# Altium project SaraKit_MainBoard.PrjPcb (part 2 of 3)

## Sheet Audio_SpeakerDriver.SchDoc
size A4; SheetNumber: 3; SheetTotal: 6
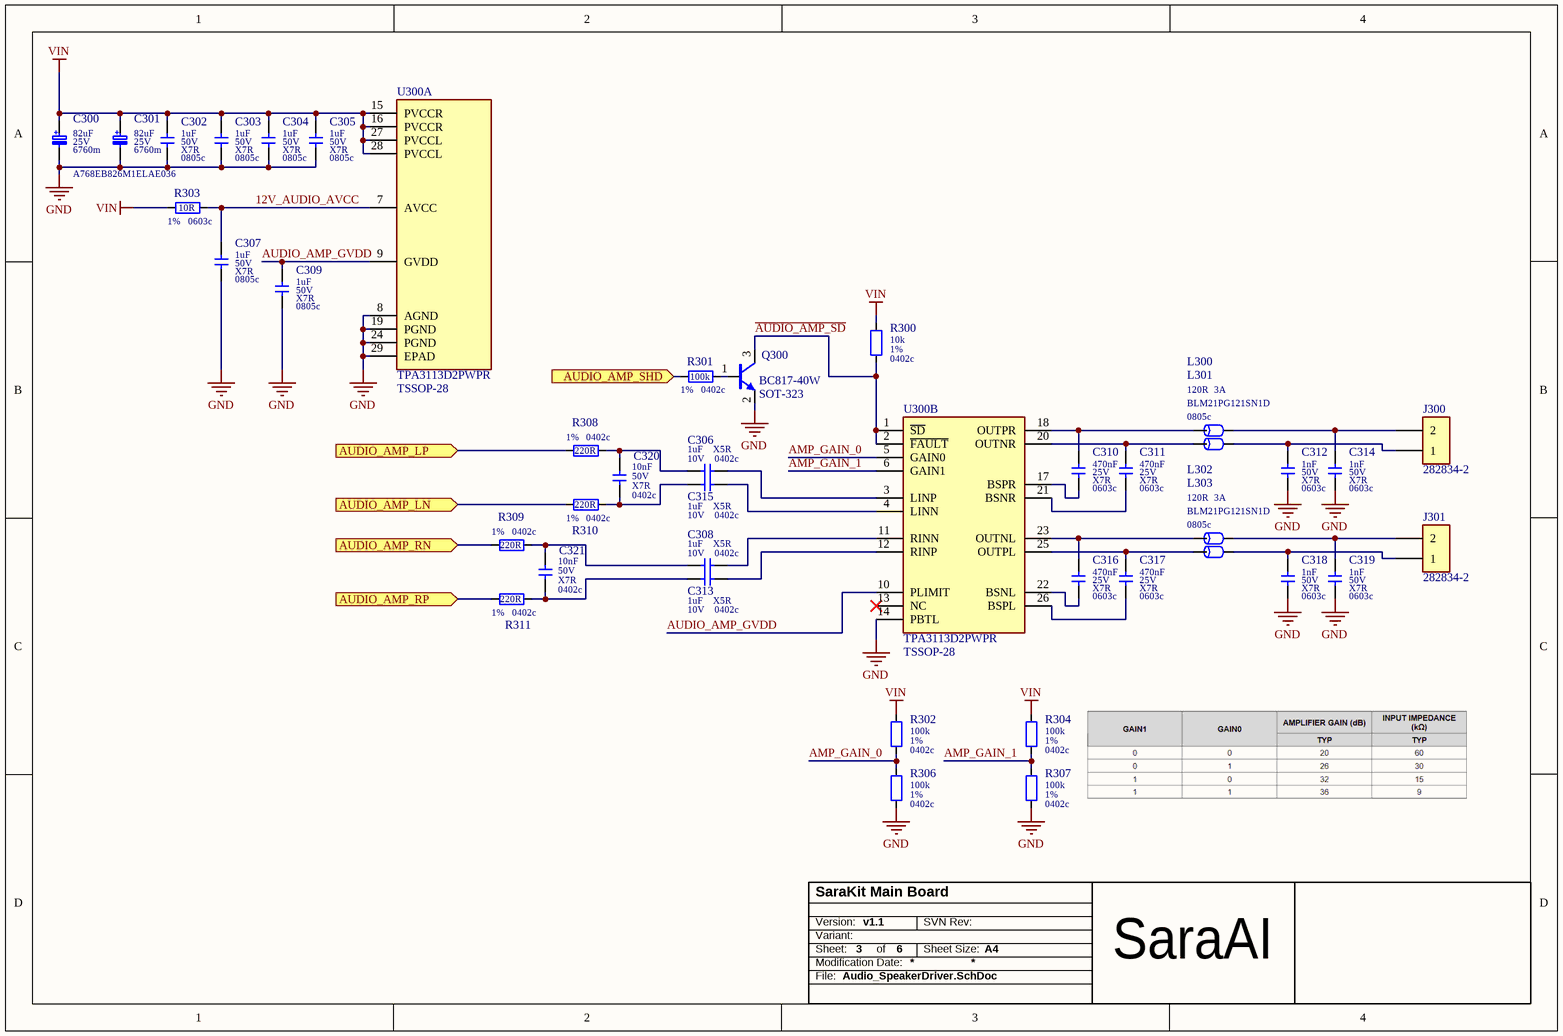
[diagram p2: Audio_SpeakerDriver.SchDoc]

### Parts
C300  09 Parameter 2: 25V  08 Parameter 1: 82uF  07 Package: 6760m  [CAPAE660X60L]  (hidden comment: A768EB826M1ELAE036)
C301  09 Parameter 2: 25V  08 Parameter 1: 82uF  07 Package: 6760m  [CAPAE660X60L]  (hidden comment: A768EB826M1ELAE036)
C302  11 Parameter 4: X7R  07 Package: 0805c  08 Parameter 1: 1uF  09 Parameter 2: 50V  [CAPC2013X145L]  (hidden comment: CL21B105KBFNNNG)
C303  11 Parameter 4: X7R  07 Package: 0805c  08 Parameter 1: 1uF  09 Parameter 2: 50V  [CAPC2013X145L]  (hidden comment: CL21B105KBFNNNG)
C304  11 Parameter 4: X7R  07 Package: 0805c  08 Parameter 1: 1uF  09 Parameter 2: 50V  [CAPC2013X145L]  (hidden comment: CL21B105KBFNNNG)
C305  11 Parameter 4: X7R  07 Package: 0805c  08 Parameter 1: 1uF  09 Parameter 2: 50V  [CAPC2013X145L]  (hidden comment: CL21B105KBFNNNG)
C306  11 Parameter 4: X5R  07 Package: 0402c  08 Parameter 1: 1uF  09 Parameter 2: 10V  [CAPC1005X60L]  (hidden comment: CL05A105KP5NNNC)
C307  11 Parameter 4: X7R  07 Package: 0805c  08 Parameter 1: 1uF  09 Parameter 2: 50V  [CAPC2013X145L]  (hidden comment: CL21B105KBFNNNG)
C308  11 Parameter 4: X5R  07 Package: 0402c  08 Parameter 1: 1uF  09 Parameter 2: 10V  [CAPC1005X60L]  (hidden comment: CL05A105KP5NNNC)
C309  11 Parameter 4: X7R  07 Package: 0805c  08 Parameter 1: 1uF  09 Parameter 2: 50V  [CAPC2013X145L]  (hidden comment: CL21B105KBFNNNG)
C310  11 Parameter 4: X7R  07 Package: 0603c  08 Parameter 1: 470nF  09 Parameter 2: 25V  [CAPC1608X90L]  (hidden comment: CL10B474KA8NNNC)
C311  11 Parameter 4: X7R  07 Package: 0603c  08 Parameter 1: 470nF  09 Parameter 2: 25V  [CAPC1608X90L]  (hidden comment: CL10B474KA8NNNC)
C312  11 Parameter 4: X7R  07 Package: 0603c  08 Parameter 1: 1nF  09 Parameter 2: 50V  [CAPC1608X90L]  (hidden comment: CL10B102KB8NNNC)
C313  11 Parameter 4: X5R  07 Package: 0402c  08 Parameter 1: 1uF  09 Parameter 2: 10V  [CAPC1005X60L]  (hidden comment: CL05A105KP5NNNC)
C314  11 Parameter 4: X7R  07 Package: 0603c  08 Parameter 1: 1nF  09 Parameter 2: 50V  [CAPC1608X90L]  (hidden comment: CL10B102KB8NNNC)
C315  11 Parameter 4: X5R  07 Package: 0402c  08 Parameter 1: 1uF  09 Parameter 2: 10V  [CAPC1005X60L]  (hidden comment: CL05A105KP5NNNC)
C316  11 Parameter 4: X7R  07 Package: 0603c  08 Parameter 1: 470nF  09 Parameter 2: 25V  [CAPC1608X90L]  (hidden comment: CL10B474KA8NNNC)
C317  11 Parameter 4: X7R  07 Package: 0603c  08 Parameter 1: 470nF  09 Parameter 2: 25V  [CAPC1608X90L]  (hidden comment: CL10B474KA8NNNC)
C318  11 Parameter 4: X7R  07 Package: 0603c  08 Parameter 1: 1nF  09 Parameter 2: 50V  [CAPC1608X90L]  (hidden comment: CL10B102KB8NNNC)
C319  11 Parameter 4: X7R  07 Package: 0603c  08 Parameter 1: 1nF  09 Parameter 2: 50V  [CAPC1608X90L]  (hidden comment: CL10B102KB8NNNC)
C320  11 Parameter 4: X7R  07 Package: 0402c  08 Parameter 1: 10nF  09 Parameter 2: 50V  [CAPC1005X60L]  (hidden comment: CL05B103KB5NNN)
C321  11 Parameter 4: X7R  07 Package: 0402c  08 Parameter 1: 10nF  09 Parameter 2: 50V  [CAPC1005X60L]  (hidden comment: CL05B103KB5NNN)
J300  282834-2  [TE 282834-2]
J301  282834-2  [TE 282834-2]
L300  09 Parameter 2: 3A  08 Parameter 1: 120R  07 Package: 0805c  [INDC2013X105L]  (hidden comment: BLM21PG121SN1D)
L301  BLM21PG121SN1D  [INDC2013X105L]  (value not drawn)
L302  09 Parameter 2: 3A  08 Parameter 1: 120R  07 Package: 0805c  [INDC2013X105L]  (hidden comment: BLM21PG121SN1D)
L303  BLM21PG121SN1D  [INDC2013X105L]  (value not drawn)
Q300  07 Package: SOT-323  [SOT65P210X110-3L]  (hidden comment: BC817-40W)
R300  07 Package: 0402c  09 Parameter 2: 1%  08 Parameter 1: 10k  [RESC1005X40L]  (hidden comment: RC0402FR-0710KL)
R301  07 Package: 0402c  09 Parameter 2: 1%  08 Parameter 1: 100k  [RESC1005X40L]  (hidden comment: RC0402FR-07100KL)
R302  07 Package: 0402c  09 Parameter 2: 1%  08 Parameter 1: 100k  [RESC1005X40L]  (hidden comment: RC0402FR-07100KL)
R303  07 Package: 0603c  09 Parameter 2: 1%  08 Parameter 1: 10R  [RESC1608X55L]  (hidden comment: RC0603FR-0710RL)
R304  07 Package: 0402c  09 Parameter 2: 1%  08 Parameter 1: 100k  [RESC1005X40L]  (hidden comment: RC0402FR-07100KL)
R306  07 Package: 0402c  09 Parameter 2: 1%  08 Parameter 1: 100k  [RESC1005X40L]  (hidden comment: RC0402FR-07100KL)
R307  07 Package: 0402c  09 Parameter 2: 1%  08 Parameter 1: 100k  [RESC1005X40L]  (hidden comment: RC0402FR-07100KL)
R308  07 Package: 0402c  09 Parameter 2: 1%  08 Parameter 1: 220R  [RESC1005X40L]  (hidden comment: RC0402FR-07220RL)
R309  07 Package: 0402c  09 Parameter 2: 1%  08 Parameter 1: 220R  [RESC1005X40L]  (hidden comment: RC0402FR-07220RL)
R310  07 Package: 0402c  09 Parameter 2: 1%  08 Parameter 1: 220R  [RESC1005X40L]  (hidden comment: RC0402FR-07220RL)
R311  07 Package: 0402c  09 Parameter 2: 1%  08 Parameter 1: 220R  [RESC1005X40L]  (hidden comment: RC0402FR-07220RL)
U300  07 Package: TSSOP-28  [TSOP65P640X120_HS-29L]  (hidden comment: TPA3113D2PWPR)  (parts A,B of 2)

### Ports
AUDIO_AMP_LN (in), AUDIO_AMP_LP (in), AUDIO_AMP_RN (in), AUDIO_AMP_RP (in), AUDIO_AMP_SHD (in)

### Nets
GND: C300.2 C301.2 C302.1 C303.1 C304.1 C305.1 C307.1 C309.1 C312.1 C314.1 C318.1 C319.1 Q300.2(E) R306.1 R307.1 U300.8(AGND) U300.14(PBTL) U300.19(PGND) U300.24(PGND) U300.29(EPAD)
VIN: C300.1 C301.1 C302.2 C303.2 C304.2 C305.2 R300.2 R302.2 R303.1 R304.2 U300.15(PVCCR) U300.16(PVCCR) U300.27(PVCCL) U300.28(PVCCL)
12V_AUDIO_AVCC: C307.2 R303.2 U300.7(AVCC)
~{AUDIO_AMP_SD}: Q300.3(C) R300.1 U300.1(~{SD}) U300.2(~{FAULT})
AMP_GAIN_0: R302.1 R306.2 U300.5(GAIN0)
AMP_GAIN_1: R304.1 R307.2 U300.6(GAIN1)
AUDIO_AMP_GVDD: C309.2 U300.9(GVDD) U300.10(PLIMIT)
AUDIO_AMP_LN: R310.1 ; port AUDIO_AMP_LN
AUDIO_AMP_LP: R308.1 ; port AUDIO_AMP_LP
AUDIO_AMP_RN: R309.1 ; port AUDIO_AMP_RN
AUDIO_AMP_RP: R311.1 ; port AUDIO_AMP_RP
G4/AMP_SHD: R301.1 ; port AUDIO_AMP_SHD
NetC306_1: C306.1 U300.3(LINP)
NetC306_2: C306.2 C320.2 R308.2
NetC308_1: C308.1 U300.11(RINN)
NetC308_2: C308.2 C321.2 R309.2
NetC310_1: C310.1 U300.17(BSPR)
NetC310_2: C310.2 L300.1 U300.18(OUTPR)
NetC311_1: C311.1 U300.21(BSNR)
NetC311_2: C311.2 L301.1 U300.20(OUTNR)
NetC312_2: C312.2 J300.1 L301.2
NetC313_1: C313.1 U300.12(RINP)
NetC313_2: C313.2 C321.1 R311.2
NetC314_2: C314.2 J300.2 L300.2
NetC315_1: C315.1 U300.4(LINN)
NetC315_2: C315.2 C320.1 R310.2
NetC316_1: C316.1 U300.22(BSNL)
NetC316_2: C316.2 L302.1 U300.23(OUTNL)
NetC317_1: C317.1 U300.26(BSPL)
NetC317_2: C317.2 L303.1 U300.25(OUTPL)
NetC318_2: C318.2 J301.1 L303.2
NetC319_2: C319.2 J301.2 L302.2
NetQ300_1: Q300.1(B) R301.2

Not connected (* = marked no-connect by the designer): U300 13(NC)*

### Notes on the sheet
- Version:
- SVN Rev:
- Sheet:
- File:
- Modification Date:
- Variant:
- of
- Sheet Size:
- A4
- SaraAI
- (in symbol 498) +

### Library data of the parts
C300 C301 = 498: SMT 6760m 82uF 25V 0,2 36mOhm 1.255A 125°; 03 Manufacturer: Kemet; 00 Index: 498; 01 Name: CAPACITOR POLYMER A768EB826M1ELAE036 Kemet; 04 Main Group: CAPACITOR; 05 Sub Group: POLYMER; 10 Parameter 3: 0,2; 16 Replacements: 25SVPK82M; Library Directory: sym_basics/; Fotprint Directory: fot_ipc/; 06 Assembly: SMT; 11 Parameter 4: 36mOhm; 12 Parameter 5: 1.255A; 13 Parameter 6: 125°; 14 Modification Date: 09.03.2021; ComponentLink1Description: DATASHEET; ComponentLink1URL: https://pl.mouser.com/datasheet/2/212/1/KEM_A4088_A768-1864506.pdf; 02 MPN: A768EB826M1ELAE036
C302-C305 C307 C309 = 30: SMT 0805c 1uF 50V 10% X7R 6.9MHz 125'C; 03 Manufacturer: Samsung; 00 Index: 30; 01 Name: CAPACITOR CERAMIC CL21B105KBFNNNG Samsung; 05 Sub Group: CERAMIC; 04 Main Group: CAPACITOR; 06 Assembly: SMT; 12 Parameter 5: 6.9MHz; 13 Parameter 6: 125'C; 14 Modification Date: 16.11.2020; ComponentLink1Description: DATASHEET; ComponentLink1URL: E:\Praca\Mindsailors\Mindsailors Altium\Database Library\Datasheets\CAPACITOR\Samsung CL21B105KBFNNNG.pdf; 02 MPN: CL21B105KBFNNNG; 10 Parameter 3: 10%
C306 C308 C313 C315 = 154: SMT 0402c 1uF 10V 10% X5R 10.2MHz 85'C; 03 Manufacturer: Samsung; 00 Index: 154; 01 Name: CAPACITOR THICK FILM CL05A105KP5NNNC Samsung; 05 Sub Group: THICK FILM; 04 Main Group: CAPACITOR; 06 Assembly: SMT; 12 Parameter 5: 10.2MHz; 13 Parameter 6: 85'C; 14 Modification Date: 16.11.2020; ComponentLink1Description: DATASHEET; ComponentLink1URL: E:\Praca\Mindsailors\Mindsailors Altium\Database Library\Datasheets\CAPACITOR\Samsung CL05A105KP5NNNC.pdf; 02 MPN: CL05A105KP5NNNC; 10 Parameter 3: 10%
C310 C311 C316 C317 = 212: SMT 0603c 470nF 25V 10% X7R 125°C; 03 Manufacturer: Samsung; 00 Index: 212; 01 Name: CAPACITOR CERAMIC CL10B474KA8NNNC Samsung; 05 Sub Group: CERAMIC; 04 Main Group: CAPACITOR; 06 Assembly: SMT; 13 Parameter 6: 125°C; 14 Modification Date: 25.01.2021; ComponentLink1Description: DATASHEET; ComponentLink1URL: http://weblib.samsungsem.com/mlcc/mlcc-ec-data-sheet.do?partNumber=CL10B474KA8NNN; 02 MPN: CL10B474KA8NNNC; 10 Parameter 3: 10%
C312 C314 C318 C319 = 191: SMT 0603c 1nF 50V 10% X7R 125°C; 03 Manufacturer: Samsung; 00 Index: 191; 01 Name: CAPACITOR CERAMIC CL10B102KB8NNNC Samsung; 05 Sub Group: CERAMIC; Library Directory: sym_basics/; Fotprint Directory: fot_ipc/; 04 Main Group: CAPACITOR; 06 Assembly: SMT; 13 Parameter 6: 125°C; 14 Modification Date: 25.01.2021; ComponentLink1Description: DATASHEET; ComponentLink1URL: http://weblib.samsungsem.com/mlcc/mlcc-ec-data-sheet.do?partNumber=CL10B102KB8NNN; 02 MPN: CL10B102KB8NNNC; 10 Parameter 3: 10%
C320 C321 = 451: SMT 0402c 10nF 50V 0,1 X7R 125°C; 03 Manufacturer: Samsung; 00 Index: 451; 01 Name: CAPACITOR CERAMIC CL05B103KB5NNN Samsung; 05 Sub Group: CERAMIC; 10 Parameter 3: 10%; 04 Main Group: CAPACITOR; 06 Assembly: SMT; 13 Parameter 6: 125°C; 14 Modification Date: 11.02.2021; ComponentLink1Description: DATASHEET; ComponentLink1URL: http://weblib.samsungsem.com/mlcc/mlcc-ec-data-sheet.do?partNumber=CL05B103KB5NNN; 02 MPN: CL05B103KB5NNN
J300 J301 = 978: THT 1x2 2.54mm Straight 150V 10A; 03 Manufacturer: TE Connectivity; 00 Index: 978; 01 Name: CONNECTOR WIRE 282834-2 TE Connectivity; 04 Main Group: CONNECTOR; 05 Sub Group: WIRE; Library Directory: sym_basics/; Fotprint Directory: fot_other/; 06 Assembly: THT; 13 Parameter 6: 10A; 14 Modification Date: 03.01.2022; ComponentLink1Description: DATASHEET; ComponentLink1URL: https://www.te.com/usa-en/product-282834-2.html; 09 Parameter 2: 2.54mm; 08 Parameter 1: 1x2; 11 Parameter 4: Straight; 12 Parameter 5: 150V; 07 Package: *; 02 MPN: 282834-2
L300-L303 = 499: SMT 0805c 120R 3A 0.035Ohm 350MHz; 03 Manufacturer: Murata; 00 Index: 499; 01 Name: INDUCTOR BEAD BLM21PG121SN1D Murata; 04 Main Group: INDUCTOR; 05 Sub Group: BEAD; 06 Assembly: SMT; 12 Parameter 5: 0.035Ohm; 13 Parameter 6: 350MHz; 14 Modification Date: 09.03.2021; ComponentLink1Description: DATASHEET; ComponentLink1URL: https://www.murata.com/en-global/api/pdfdownloadapi?cate=cgsubChipFerriBead&partno=BLM21PG121SZ1%23; 02 MPN: BLM21PG121SN1D
  L301 L303: 09 Parameter 2: 3A; 08 Parameter 1: 120R; 07 Package: 0805c
Q300 = 93: SMT SOT-323 NPN 45V 0.5A 0.2W; 03 Manufacturer: Nexperia; 00 Index: 93; 01 Name: TRANSISTOR BIPOLAR BC817-40W Nexperia; 04 Main Group: TRANSISTOR; 05 Sub Group: BIPOLAR; 06 Assembly: SMT; 13 Parameter 6: 0.2W; 14 Modification Date: 16.11.2020; ComponentLink1Description: DATASHEET; ComponentLink1URL: E:\Praca\Mindsailors\Mindsailors Altium\Database Library\Datasheets\TRANSISTOR\Nexperia BC817W Series.pdf; 08 Parameter 1: NPN; 11 Parameter 4: 45V; 12 Parameter 5: 0.5A; 02 MPN: BC817-40W
R300 = 15: as R109 on sheet Main; 04 Main Group: RESISTOR; 06 Assembly: SMT; 11 Parameter 4: 100ppm/K; 12 Parameter 5: 50V; 14 Modification Date: 16.11.2020; ComponentLink1Description: DATASHEET; ComponentLink1URL: E:\Praca\Mindsailors\Mindsailors Altium\Database Library\Datasheets\RESISTOR\Yageo RC_L Series.pdf; 10 Parameter 3: 62.5mW; 02 MPN: RC0402FR-0710KL
R301 = 18: SMT 0402c 100k 1% 62.5mW 100ppm/K 50V; 03 Manufacturer: Yageo; 00 Index: 18; 01 Name: RESISTOR THICK FILM RC0402FR-07100KL Yageo; 05 Sub Group: THICK FILM; 04 Main Group: RESISTOR; 06 Assembly: SMT; 11 Parameter 4: 100ppm/K; 12 Parameter 5: 50V; 14 Modification Date: 16.11.2020; ComponentLink1Description: DATASHEET; ComponentLink1URL: E:\Praca\Mindsailors\Mindsailors Altium\Database Library\Datasheets\RESISTOR\Yageo RC_L Series.pdf; 10 Parameter 3: 62.5mW; 02 MPN: RC0402FR-07100KL
R302 R304 R306 R307 = 18: SMT 0402c 100k 1% 62.5mW 100ppm/K 50V; 03 Manufacturer: Yageo; 00 Index: 18; 01 Name: RESISTOR THICK FILM RC0402FR-07100KL Yageo; 05 Sub Group: THICK FILM; Library Directory: sym_basics/; Fotprint Directory: fot_ipc/; 04 Main Group: RESISTOR; 06 Assembly: SMT; 11 Parameter 4: 100ppm/K; 12 Parameter 5: 50V; 14 Modification Date: 16.11.2020; ComponentLink1Description: DATASHEET; ComponentLink1URL: E:\Praca\Mindsailors\Mindsailors Altium\Database Library\Datasheets\RESISTOR\Yageo RC_L Series.pdf; 10 Parameter 3: 62.5mW; 02 MPN: RC0402FR-07100KL
R303 = 265: SMT 0603c 10R 1% 100mW 100ppm/K 75V; 03 Manufacturer: Yageo; 00 Index: 265; 01 Name: RESISTOR THICK FILM RC0603FR-0710RL Yageo; 05 Sub Group: THICK FILM; 04 Main Group: RESISTOR; 06 Assembly: SMT; 11 Parameter 4: 100ppm/K; 12 Parameter 5: 75V; 14 Modification Date: 25.01.2021; ComponentLink1Description: DATASHEET; ComponentLink1URL: https://www.yageo.com/upload/media/product/products/datasheet/rchip/PYu-RC_Group_51_RoHS_L_11.pdf; 10 Parameter 3: 100mW; 02 MPN: RC0603FR-0710RL
R308-R311 = 605: SMT 0402c 220R 1% 62.5mW 100ppm/K 50V; 03 Manufacturer: Yageo; 00 Index: 605; 01 Name: RESISTOR THICK FILM RC0402FR-07220RL Yageo; 05 Sub Group: THICK FILM; Library Directory: sym_basics/; Fotprint Directory: fot_ipc/; 04 Main Group: RESISTOR; 06 Assembly: SMT; 11 Parameter 4: 100ppm/K; 12 Parameter 5: 50V; 14 Modification Date: 10.05.2021; ComponentLink1Description: DATASHEET; ComponentLink1URL: https://www.yageo.com/upload/media/product/products/datasheet/rchip/PYu-RC_Group_51_RoHS_L_11.pdf; 10 Parameter 3: 62.5mW; 02 MPN: RC0402FR-07220RL
U300 = 497: SMT TSSOP-28 Speaker 8V - 26V 2x 6W; 03 Manufacturer: Texas Instruments; 00 Index: 497; 01 Name: IC DRIVER TPA3113D2PWPR Texas Instruments; 04 Main Group: IC; 05 Sub Group: DRIVER; 11 Parameter 4: 8V - 26V; 12 Parameter 5: 2x 6W; 06 Assembly: SMT; 14 Modification Date: 08.03.2021; ComponentLink1Description: DATASHEET; ComponentLink1URL: https://www.ti.com/lit/ds/symlink/tpa3113d2.pdf?ts=1615202642368&ref_url=https%253A%252F%252Fwww.google.com%252F; 08 Parameter 1: Speaker; 02 MPN: TPA3113D2PWPR

## Sheet MotorsController.SchDoc
size A3; SheetNumber: 4; SheetTotal: 6
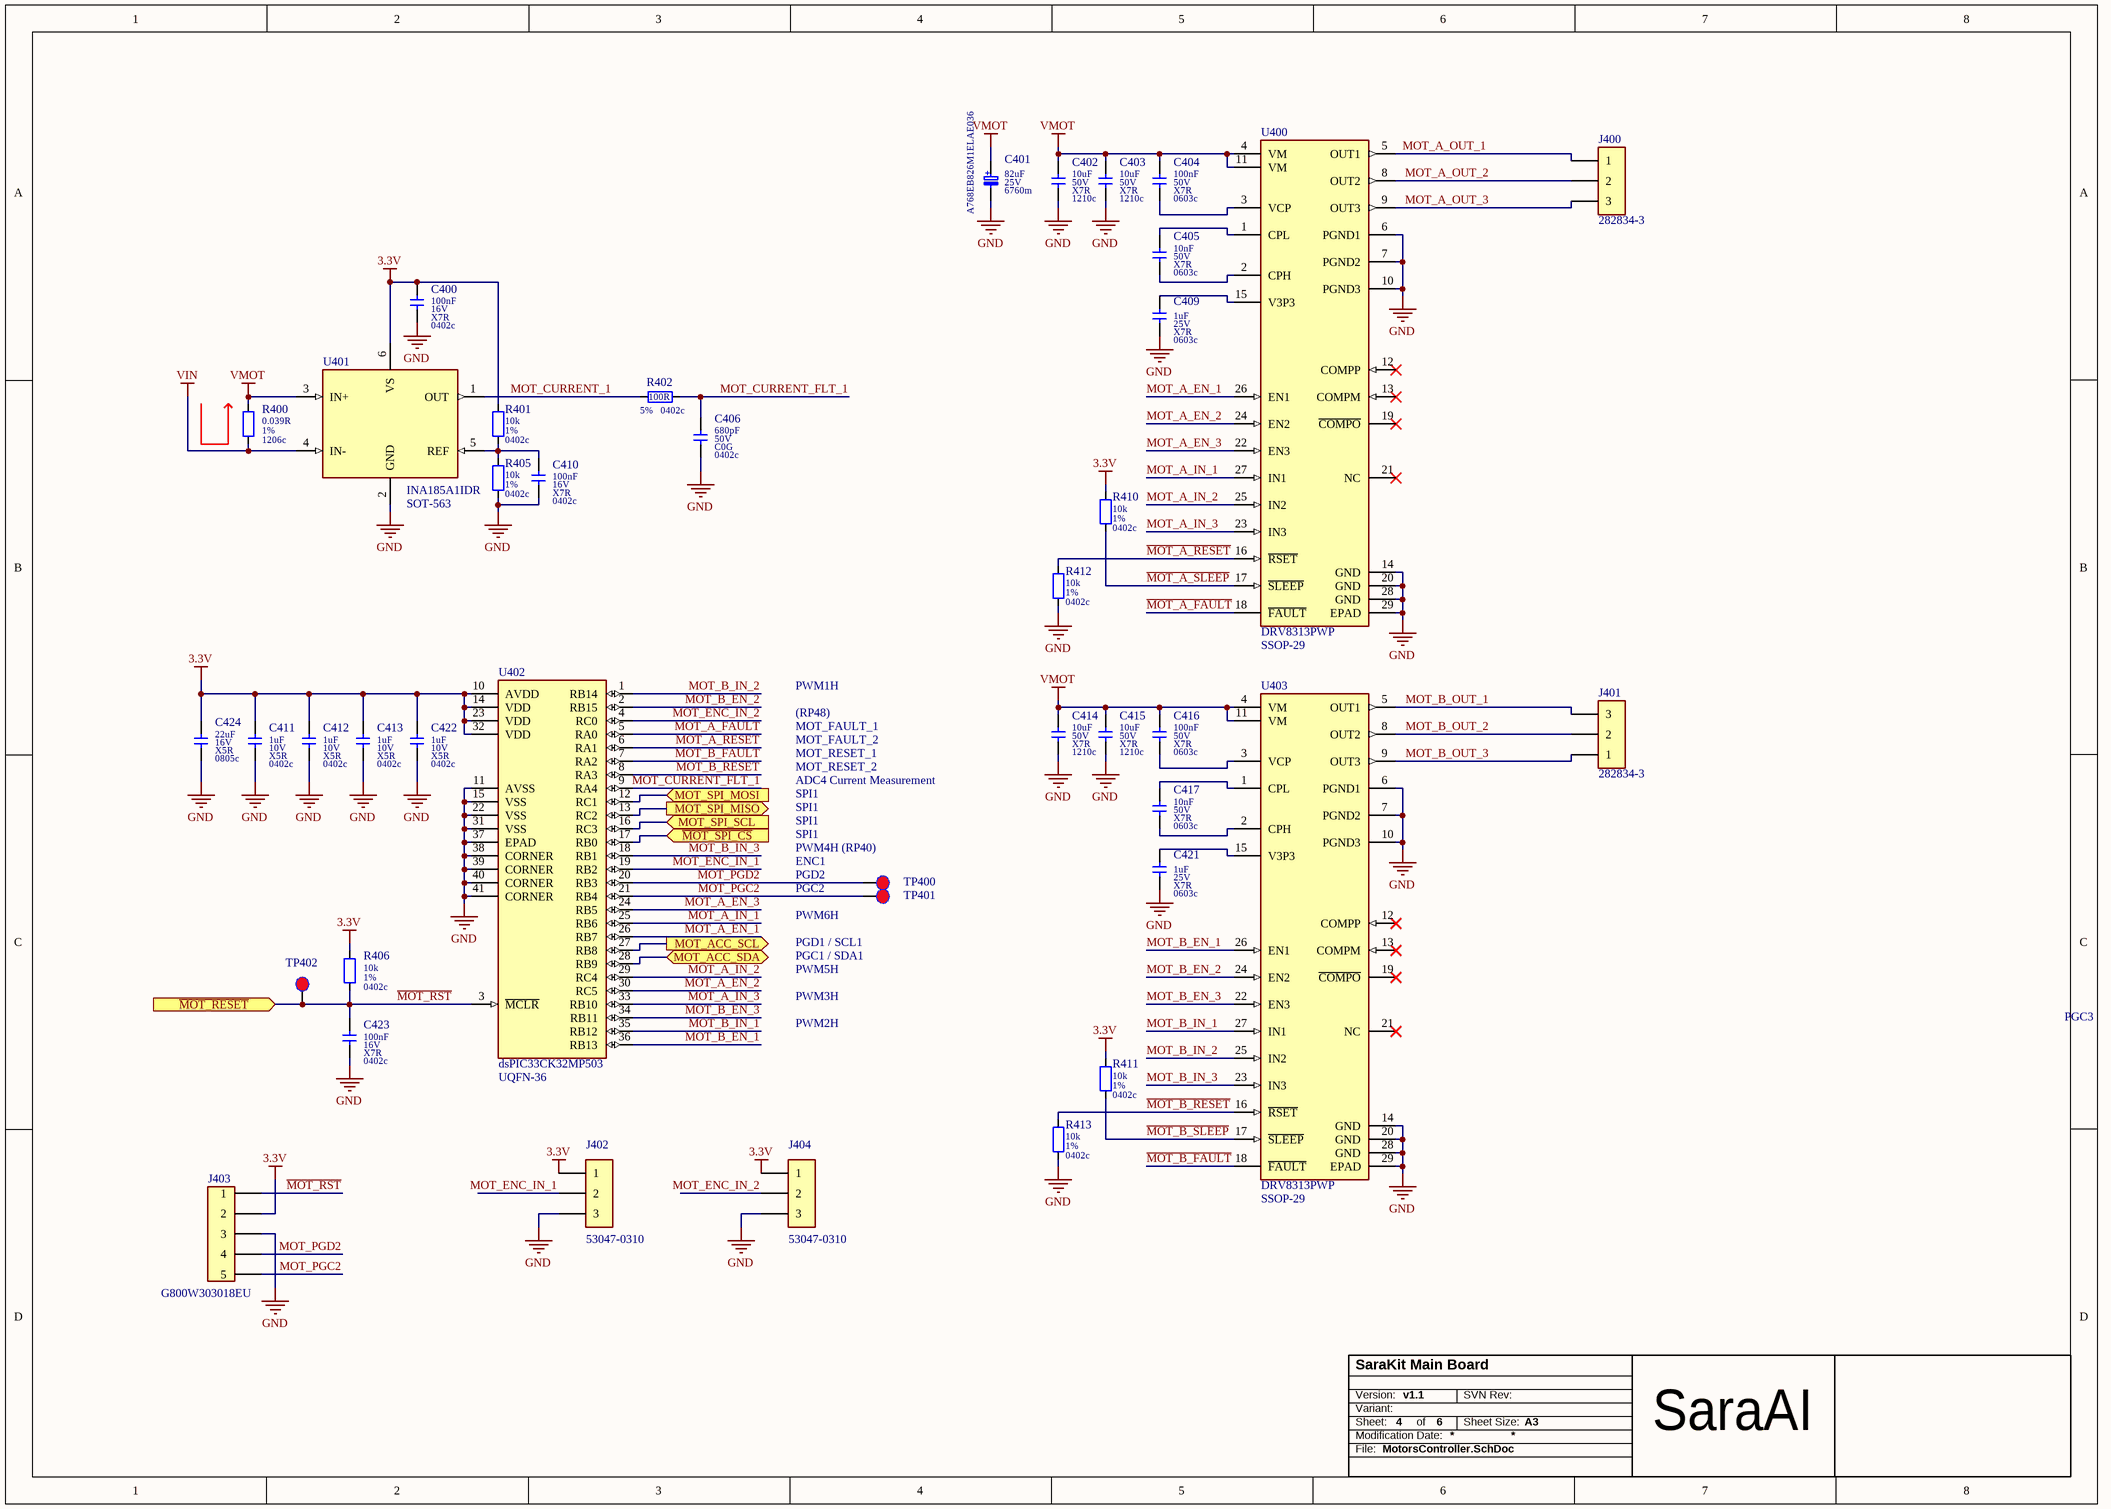
[diagram p3: MotorsController.SchDoc]

### Parts
C400  11 Parameter 4: X7R  07 Package: 0402c  08 Parameter 1: 100nF  09 Parameter 2: 16V  [CAPC1005X60L]  (hidden comment: CL05B104KO5NNNC)
C401  09 Parameter 2: 25V  08 Parameter 1: 82uF  07 Package: 6760m  [CAPAE660X60L]  (hidden comment: A768EB826M1ELAE036)
C402  11 Parameter 4: X7R  07 Package: 1210c  08 Parameter 1: 10uF  09 Parameter 2: 50V  [CAPC3225X270L]  (hidden comment: CL32B106KBJNNNE)
C403  11 Parameter 4: X7R  07 Package: 1210c  08 Parameter 1: 10uF  09 Parameter 2: 50V  [CAPC3225X270L]  (hidden comment: CL32B106KBJNNNE)
C404  11 Parameter 4: X7R  07 Package: 0603c  08 Parameter 1: 100nF  09 Parameter 2: 50V  [CAPC1608X90L]  (hidden comment: CL10B104KB8NNNC)
C405  11 Parameter 4: X7R  07 Package: 0603c  08 Parameter 1: 10nF  09 Parameter 2: 50V  [CAPC1608X90L]  (hidden comment: CL10B103KB8NNNC)
C406  11 Parameter 4: C0G  07 Package: 0402c  08 Parameter 1: 680pF  09 Parameter 2: 50V  [CAPC1005X60L]  (hidden comment: C0402C681J5GAC)
C409  11 Parameter 4: X7R  07 Package: 0603c  08 Parameter 1: 1uF  09 Parameter 2: 25V  [CAPC1608X90L]  (hidden comment: CL10B105KA8NNNC)
C410  11 Parameter 4: X7R  07 Package: 0402c  08 Parameter 1: 100nF  09 Parameter 2: 16V  [CAPC1005X60L]  (hidden comment: CL05B104KO5NNNC)
C411  11 Parameter 4: X5R  07 Package: 0402c  08 Parameter 1: 1uF  09 Parameter 2: 10V  [CAPC1005X60L]  (hidden comment: CL05A105KP5NNNC)
C412  11 Parameter 4: X5R  07 Package: 0402c  08 Parameter 1: 1uF  09 Parameter 2: 10V  [CAPC1005X60L]  (hidden comment: CL05A105KP5NNNC)
C413  11 Parameter 4: X5R  07 Package: 0402c  08 Parameter 1: 1uF  09 Parameter 2: 10V  [CAPC1005X60L]  (hidden comment: CL05A105KP5NNNC)
C414  11 Parameter 4: X7R  07 Package: 1210c  08 Parameter 1: 10uF  09 Parameter 2: 50V  [CAPC3225X270L]  (hidden comment: CL32B106KBJNNNE)
C415  11 Parameter 4: X7R  07 Package: 1210c  08 Parameter 1: 10uF  09 Parameter 2: 50V  [CAPC3225X270L]  (hidden comment: CL32B106KBJNNNE)
C416  11 Parameter 4: X7R  07 Package: 0603c  08 Parameter 1: 100nF  09 Parameter 2: 50V  [CAPC1608X90L]  (hidden comment: CL10B104KB8NNNC)
C417  11 Parameter 4: X7R  07 Package: 0603c  08 Parameter 1: 10nF  09 Parameter 2: 50V  [CAPC1608X90L]  (hidden comment: CL10B103KB8NNNC)
C421  11 Parameter 4: X7R  07 Package: 0603c  08 Parameter 1: 1uF  09 Parameter 2: 25V  [CAPC1608X90L]  (hidden comment: CL10B105KA8NNNC)
C422  11 Parameter 4: X5R  07 Package: 0402c  08 Parameter 1: 1uF  09 Parameter 2: 10V  [CAPC1005X60L]  (hidden comment: CL05A105KP5NNNC)
C423  11 Parameter 4: X7R  07 Package: 0402c  08 Parameter 1: 100nF  09 Parameter 2: 16V  [CAPC1005X60L]  (hidden comment: CL05B104KO5NNNC)
C424  11 Parameter 4: X5R  07 Package: 0805c  08 Parameter 1: 22uF  09 Parameter 2: 16V  [CAPC2013X145L]  (hidden comment: CL21A226MOQNNNE)
J400  282834-3  [TE 282834-3]
J401  282834-3  [TE 282834-3]
J402  53047-0310  [MOLEX 53047-0310]
J403  G800W303018EU  [Goldpin 2.54 1x5]
J404  53047-0310  [MOLEX 53047-0310]
R400  07 Package: 1206c  09 Parameter 2: 1%  08 Parameter 1: 0.039R  [RESC3216X65L]  (hidden comment: ERJ-8CWFR039V)
R401  07 Package: 0402c  09 Parameter 2: 1%  08 Parameter 1: 10k  [RESC1005X40L]  (hidden comment: RC0402FR-0710KL)
R402  07 Package: 0402c  09 Parameter 2: 5%  08 Parameter 1: 100R  [RESC1005X40L]  (hidden comment: 0402WGJ0101TCE)
R405  07 Package: 0402c  09 Parameter 2: 1%  08 Parameter 1: 10k  [RESC1005X40L]  (hidden comment: RC0402FR-0710KL)
R406  07 Package: 0402c  09 Parameter 2: 1%  08 Parameter 1: 10k  [RESC1005X40L]  (hidden comment: RC0402FR-0710KL)
R410  07 Package: 0402c  09 Parameter 2: 1%  08 Parameter 1: 10k  [RESC1005X40L]  (hidden comment: RC0402FR-0710KL)
R411  07 Package: 0402c  09 Parameter 2: 1%  08 Parameter 1: 10k  [RESC1005X40L]  (hidden comment: RC0402FR-0710KL)
R412  07 Package: 0402c  09 Parameter 2: 1%  08 Parameter 1: 10k  [RESC1005X40L]  (hidden comment: RC0402FR-0710KL)
R413  07 Package: 0402c  09 Parameter 2: 1%  08 Parameter 1: 10k  [RESC1005X40L]  (hidden comment: RC0402FR-0710KL)
TP400  TESTPAD  [TP 1.2mm]  (value not drawn)  (no BOM)
TP401  TESTPAD  [TP 1.2mm]  (value not drawn)  (no BOM)
TP402  TESTPAD  [TP 1.2mm]  (value not drawn)  (no BOM)
U400  07 Package: SSOP-29  [SOP65P640X110-HS52x31-29L]  (hidden comment: DRV8313PWP)
U401  07 Package: SOT-563  [SOT50P160X120X60_6L]  (hidden comment: INA185A1IDR)
U402  07 Package: UQFN-36  [QFN40P500X500X60-36_41L]  (hidden comment: dsPIC33CK32MP503)
U403  07 Package: SSOP-29  [SOP65P640X110-HS52x31-29L]  (hidden comment: DRV8313PWP)

### Ports
MOT_ACC_SCL (out), MOT_ACC_SDA (bidir), MOT_SPI_MISO (out), MOT_SPI_MOSI (in), MOT_SPI_SCL (in), ~{MOT_RESET} (in), ~{MOT_SPI_CS} (in)

### Nets
3.3V: C400.2 C411.2 C412.2 C413.2 C422.2 C424.2 J402.1 J403.2 J404.1 R401.2 R406.2 R410.2 R411.2 U401.6(VS) U402.10(AVDD) U402.14(VDD) U402.23(VDD) U402.32(VDD)
GND: C400.1 C401.2 C402.1 C403.1 C406.1 C409.1 C410.1 C411.1 C412.1 C413.1 C414.1 C415.1 C421.1 C422.1 C423.1 C424.1 J402.3 J403.3 J404.3 R405.1 R412.1 R413.1 U400.6(PGND1) U400.7(PGND2) U400.10(PGND3) U400.14(GND) U400.20(GND) U400.28(GND) U400.29(EPAD) U401.2(GND) U402.11(AVSS) U402.15(VSS) U402.22(VSS) U402.31(VSS) U402.37(EPAD) U402.38(CORNER) U402.39(CORNER) U402.40(CORNER) U402.41(CORNER) U403.6(PGND1) U403.7(PGND2) U403.10(PGND3) U403.14(GND) U403.20(GND) U403.28(GND) U403.29(EPAD)
VIN: R400.1 U401.4(IN-)
VMOT: C401.1 C402.2 C403.2 C404.2 C414.2 C415.2 C416.2 R400.2 U400.4(VM) U400.11(VM) U401.3(IN+) U403.4(VM) U403.11(VM)
~{G7/SPI0_CE1}: U402.17(RB0) ; port ~{MOT_SPI_CS}
~{MOT_A_FAULT}: U400.18(~{FAULT}) U402.5(RA0)
~{MOT_A_RESET}: R412.2 U400.16(~{RSET}) U402.6(RA1)
~{MOT_A_SLEEP}: R410.1 U400.17(~{SLEEP})
~{MOT_B_FAULT}: U402.7(RA2) U403.18(~{FAULT})
~{MOT_B_RESET}: R413.2 U402.8(RA3) U403.16(~{RSET})
~{MOT_B_SLEEP}: R411.1 U403.17(~{SLEEP})
~{MOT_RST}: C423.2 J403.1 R406.1 TP402.1 U402.3(~{MCLR}) ; port ~{MOT_RESET}  [project net ~{G17/PIC_RST}]
G9/SPI0_MISO: U402.13(RC2) ; port MOT_SPI_MISO
G10/SPI0_MOSI: U402.12(RC1) ; port MOT_SPI_MOSI
G11/SPI0_SCK: U402.16(RC3) ; port MOT_SPI_SCL
MOT_A_EN_1: U400.26(EN1) U402.26(RB7)
MOT_A_EN_2: U400.24(EN2) U402.30(RC5)
MOT_A_EN_3: U400.22(EN3) U402.24(RB5)
MOT_A_IN_1: U400.27(IN1) U402.25(RB6)
MOT_A_IN_2: U400.25(IN2) U402.29(RC4)
MOT_A_IN_3: U400.23(IN3) U402.33(RB10)
MOT_A_OUT_1: J400.1 U400.5(OUT1)
MOT_A_OUT_2: J400.2 U400.8(OUT2)
MOT_A_OUT_3: J400.3 U400.9(OUT3)
MOT_ACC_SCL: U402.27(RB8) ; port MOT_ACC_SCL
MOT_ACC_SDA: U402.28(RB9) ; port MOT_ACC_SDA
MOT_B_EN_1: U402.36(RB13) U403.26(EN1)
MOT_B_EN_2: U402.2(RB15) U403.24(EN2)
MOT_B_EN_3: U402.34(RB11) U403.22(EN3)
MOT_B_IN_1: U402.35(RB12) U403.27(IN1)
MOT_B_IN_2: U402.1(RB14) U403.25(IN2)
MOT_B_IN_3: U402.18(RB1) U403.23(IN3)
MOT_B_OUT_1: J401.3 U403.5(OUT1)
MOT_B_OUT_2: J401.2 U403.8(OUT2)
MOT_B_OUT_3: J401.1 U403.9(OUT3)
MOT_CURRENT_1: R402.1 U401.1(OUT)
MOT_CURRENT_FLT_1: C406.2 R402.2 U402.9(RA4)
MOT_ENC_IN_1: J402.2 U402.19(RB2)
MOT_ENC_IN_2: J404.2 U402.4(RC0)
MOT_PGC2: J403.5 TP401.1 U402.21(RB4)
MOT_PGD2: J403.4 TP400.1 U402.20(RB3)
NetC404_1: C404.1 U400.3(VCP)
NetC405_1: C405.1 U400.2(CPH)
NetC405_2: C405.2 U400.1(CPL)
NetC409_2: C409.2 U400.15(V3P3)
NetC410_2: C410.2 R401.1 R405.2 U401.5(REF)
NetC416_1: C416.1 U403.3(VCP)
NetC417_1: C417.1 U403.2(CPH)
NetC417_2: C417.2 U403.1(CPL)
NetC421_2: C421.2 U403.15(V3P3)

Not connected (* = marked no-connect by the designer): U400 12(COMPP)* 13(COMPM)* 19(~{COMPO})* 21(NC)*; U403 12(COMPP)* 13(COMPM)* 19(~{COMPO})* 21(NC)*

### Notes on the sheet
- PWM1H
- (RP48)
- MOT_FAULT_1
- MOT_FAULT_2
- MOT_RESET_1
- MOT_RESET_2
- ADC4 Current Measurement
- PWM4H (RP40)
- SPI1
- PWM6H
- ENC1
- PGD2
- PGC2
- PWM5H
- PGD1 / SCL1
- PGC1 / SDA1
- PWM2H
- PWM3H
- PGC3
- Version:
- SVN Rev:
- Sheet:
- File:
- Modification Date:
- Variant:
- of
- Sheet Size:
- A3
- SaraAI
- (in symbol 498) +

### Library data of the parts
C400 C410 C423 = 138: as C208 on sheet Audio; 04 Main Group: CAPACITOR; 06 Assembly: SMT; 12 Parameter 5: 25.8MHz; 13 Parameter 6: 125'C; 14 Modification Date: 16.11.2020; ComponentLink1Description: DATASHEET; ComponentLink1URL: E:\Praca\Mindsailors\Mindsailors Altium\Database Library\Datasheets\CAPACITOR\Samsung CL05B104KO5NNNC.pdf; 02 MPN: CL05B104KO5NNNC; 10 Parameter 3: 10%
C401 = 498: as C300 on sheet Audio_SpeakerDriver; 06 Assembly: SMT; 11 Parameter 4: 36mOhm; 12 Parameter 5: 1.255A; 13 Parameter 6: 125°; 14 Modification Date: 09.03.2021; ComponentLink1Description: DATASHEET; ComponentLink1URL: https://pl.mouser.com/datasheet/2/212/1/KEM_A4088_A768-1864506.pdf; 02 MPN: A768EB826M1ELAE036
C402 C403 C414 C415 = 259: SMT 1210c 10uF 50V 10% X7R 125°C; 03 Manufacturer: Samsung; 00 Index: 259; 01 Name: CAPACITOR CERAMIC CL32B106KBJNNNC Samsung; 05 Sub Group: CERAMIC; 04 Main Group: CAPACITOR; 06 Assembly: SMT; 13 Parameter 6: 125°C; 14 Modification Date: 25.01.2021; ComponentLink1Description: DATASHEET; ComponentLink1URL: http://weblib.samsungsem.com/mlcc/mlcc-ec-data-sheet.do?partNumber=CL32B106KBJNNN; 02 MPN: CL32B106KBJNNNE; 10 Parameter 3: 10%
C404 C416 = 164: SMT 0603c 100nF 50V 10% X7R 125'C; 03 Manufacturer: Samsung; 00 Index: 164; 01 Name: CAPACITOR CERAMIC CL10B104KB8NNNC Samsung; 05 Sub Group: CERAMIC; 04 Main Group: CAPACITOR; 06 Assembly: SMT; 13 Parameter 6: 125'C; 14 Modification Date: 21.12.2020; ComponentLink1Description: DATASHEET; ComponentLink1URL: E:\Praca\Mindsailors\Mindsailors Altium\Database Library\Datasheets\CAPACITOR\Samsung CL01B104KB8NNNC.pdf; 02 MPN: CL10B104KB8NNNC; 10 Parameter 3: 10%
C405 C417 = 192: SMT 0603c 10nF 50V 10% X7R 125°C; 03 Manufacturer: Samsung; 00 Index: 192; 01 Name: CAPACITOR CERAMIC CL10B103KB8NNNC Samsung; 05 Sub Group: CERAMIC; 04 Main Group: CAPACITOR; 06 Assembly: SMT; 13 Parameter 6: 125°C; 14 Modification Date: 25.01.2021; ComponentLink1Description: DATASHEET; ComponentLink1URL: http://weblib.samsungsem.com/mlcc/mlcc-ec-data-sheet.do?partNumber=CL10B103KB8NNN; 02 MPN: CL10B103KB8NNNC; 10 Parameter 3: 10%
C406 = 990: SMT 0402c 680pF 50V 0,05 C0G 229MHz 125'C; 03 Manufacturer: Kemet; 00 Index: 990; 01 Name: CAPACITOR CERAMIC C0402C681J5GAC Kemet; 05 Sub Group: CERAMIC; 10 Parameter 3: 5%; Library Directory: sym_basics/; Fotprint Directory: fot_ipc/; 04 Main Group: CAPACITOR; 06 Assembly: SMT; 12 Parameter 5: 229MHz; 13 Parameter 6: 125'C; 14 Modification Date: 16.03.2022; ComponentLink1Description: DATASHEET; ComponentLink1URL: https://www.kemet.com/en/us/capacitors/ceramic/kc-link/product/C0402C681J5GAC%7BBULK%7D.html; 02 MPN: C0402C681J5GAC
C409 C421 = 193: SMT 0603c 1uF 25V 10% X7R 125°C; 03 Manufacturer: Samsung; 00 Index: 193; 01 Name: CAPACITOR CERAMIC CL10B105KA8NNNC Samsung; 05 Sub Group: CERAMIC; 04 Main Group: CAPACITOR; 06 Assembly: SMT; 13 Parameter 6: 125°C; 14 Modification Date: 25.01.2021; ComponentLink1Description: DATASHEET; ComponentLink1URL: http://weblib.samsungsem.com/mlcc/mlcc-ec-data-sheet.do?partNumber=CL10B105KA8NNN; 02 MPN: CL10B105KA8NNNC; 10 Parameter 3: 10%
C411-C413 C422 = 154: as C306 on sheet Audio_SpeakerDriver; 04 Main Group: CAPACITOR; 06 Assembly: SMT; 12 Parameter 5: 10.2MHz; 13 Parameter 6: 85'C; 14 Modification Date: 16.11.2020; ComponentLink1Description: DATASHEET; ComponentLink1URL: E:\Praca\Mindsailors\Mindsailors Altium\Database Library\Datasheets\CAPACITOR\Samsung CL05A105KP5NNNC.pdf; 02 MPN: CL05A105KP5NNNC; 10 Parameter 3: 10%
C424 = 81: as C102 on sheet Main; 04 Main Group: CAPACITOR; 06 Assembly: SMT; 12 Parameter 5: 1.6MHz; 13 Parameter 6: 85'C; 14 Modification Date: 16.11.2020; ComponentLink1Description: DATASHEET; ComponentLink1URL: E:\Praca\Mindsailors\Mindsailors Altium\Database Library\Datasheets\CAPACITOR\Samsung CL21A226MOQNNN.pdf; 02 MPN: CL21A226MOQNNNE; 10 Parameter 3: 20%
J400 J401 = 979: THT 1x3 2.54mm Straight 150V 10A; 03 Manufacturer: TE Connectivity; 00 Index: 979; 01 Name: CONNECTOR WIRE 282834-3 TE Connectivity; 04 Main Group: CONNECTOR; 05 Sub Group: WIRE; Library Directory: sym_basics/; Fotprint Directory: fot_other/; 06 Assembly: THT; 13 Parameter 6: 10A; 14 Modification Date: 04.01.2022; ComponentLink1Description: DATASHEET; ComponentLink1URL: https://www.te.com/usa-en/product-282834-2.html; 09 Parameter 2: 2.54mm; 08 Parameter 1: 1x3; 11 Parameter 4: Straight; 12 Parameter 5: 150V; 02 MPN: 282834-3; 07 Package: *
J402 J404 = 991: THT 1x3 1.25mm Straight 125V 1A; 03 Manufacturer: Molex; 00 Index: 991; 01 Name: CONNECTOR WIRE 53047-0310 Molex; 04 Main Group: CONNECTOR; 05 Sub Group: WIRE; Library Directory: sym_basics/; Fotprint Directory: fot_other/; 06 Assembly: THT; 13 Parameter 6: 1A; 14 Modification Date: 28.03.2022; ComponentLink1Description: DATASHEET; ComponentLink1URL: https://www.tme.eu/Document/f8f78d18d800f08aedb247ee6832d80d/mx53047.pdf; 09 Parameter 2: 1.25mm; 08 Parameter 1: 1x3; 11 Parameter 4: Straight; 12 Parameter 5: 125V; 02 MPN: 53047-0310; 07 Package: *
J403 = 982: THT 1X5 2.54mm Straight 110V 3A; 03 Manufacturer: Amphenol; 00 Index: 982; 01 Name: CONNECTOR WIRE G800W303018EU Amphenol; 04 Main Group: CONNECTOR; 05 Sub Group: WIRE; Library Directory: sym_basics/; Fotprint Directory: fot_other/; 06 Assembly: THT; 13 Parameter 6: 3A; 14 Modification Date: 10.01.2022; ComponentLink1Description: DATASHEET; ComponentLink1URL: https://www.mouser.pl/ProductDetail/Amphenol-Commercial-Products/G800W303018EU?qs=f9yNj16SXrJ5tCX5FPao9w%3D%3D; 09 Parameter 2: 2.54mm; 08 Parameter 1: 1X5; 11 Parameter 4: Straight; 12 Parameter 5: 110V; 07 Package: *; 02 MPN: G800W303018EU
R400 = 507: SMT 1206c 0.039R 1% 1W 50ppm/K; 03 Manufacturer: Panasonic; 00 Index: 507; 01 Name: RESISTOR THICK FILM ERJ-8CWFR039V Panasonic; 05 Sub Group: THICK FILM; 04 Main Group: RESISTOR; 06 Assembly: SMT; 11 Parameter 4: 50ppm/K; 14 Modification Date: 15.03.2021; ComponentLink1Description: DATASHEET; ComponentLink1URL: https://datasheet.octopart.com/ERJ-8CWFR039V-Panasonic-datasheet-28468620.pdf; 10 Parameter 3: 1W; 02 MPN: ERJ-8CWFR039V
R401 R405 R406 R410-R413 = 15: as R109 on sheet Main; 04 Main Group: RESISTOR; 06 Assembly: SMT; 11 Parameter 4: 100ppm/K; 12 Parameter 5: 50V; 14 Modification Date: 16.11.2020; ComponentLink1Description: DATASHEET; ComponentLink1URL: E:\Praca\Mindsailors\Mindsailors Altium\Database Library\Datasheets\RESISTOR\Yageo RC_L Series.pdf; 10 Parameter 3: 62.5mW; 02 MPN: RC0402FR-0710KL
R402 = 129: SMT 0402c 100R 5% 62.5mW 200ppm/K 50V; 03 Manufacturer: Royal Ohm; 00 Index: 129; 01 Name: RESISTOR THICK FILM 0402WGJ0101TCE Royal Ohm; 05 Sub Group: THICK FILM; Library Directory: sym_basics/; Fotprint Directory: fot_ipc/; 04 Main Group: RESISTOR; 06 Assembly: SMT; 11 Parameter 4: 200ppm/K; 12 Parameter 5: 50V; 14 Modification Date: 16.11.2020; ComponentLink1Description: DATASHEET; ComponentLink1URL: E:\Praca\Mindsailors\Mindsailors Altium\Database Library\Datasheets\RESISTOR\ROYAL OHM Thick Film Chip Resistors.pdf; 10 Parameter 3: 62.5mW; 02 MPN: 0402WGJ0101TCE
TP400-TP402 = 10: as TP101 on sheet Main; 02 MPN: TESTPAD; 05 Sub Group: TESTPAD; 14 Modification Date: 16.11.2020
U400 U403 = 989: SMT SSOP-29 Motor 60V 2.5A; 03 Manufacturer: Texas Instruments; 00 Index: 989; 01 Name: IC DRIVER DRV8313PWP Texas Instruments; 04 Main Group: IC; 05 Sub Group: DRIVER; Library Directory: sym_other/; Fotprint Directory: fot_ipc/; 06 Assembly: SMT; 11 Parameter 4: 60V; 12 Parameter 5: 2.5A; 14 Modification Date: 16.03.2022; ComponentLink1Description: DATASHEET; ComponentLink1URL: https://www.ti.com/lit/ds/symlink/drv8313.pdf?ts=1612516575666&ref_url=https%253A%252F%252Fwww.ti.com%252Fmotor-drivers%252Fbrushless-dc-bldc-drivers%252Fproducts.html%253Fpqs%253Dpaqs%2526familyid%253D2009; 08 Parameter 1: Motor; 02 MPN: DRV8313PWP
U401 = 506: SMT SOT-563 1 350kHz 2V/us; 03 Manufacturer: Texas Instruments; 00 Index: 506; 01 Name: IC AMPLIFIER INA185A1IDR Texas Instruments; 04 Main Group: IC; 05 Sub Group: AMPLIFIER; 11 Parameter 4: 1; 06 Assembly: SMT; 12 Parameter 5: 350kHz; 13 Parameter 6: 2V/us; 14 Modification Date: 15.03.2021; ComponentLink1Description: DATASHEET; ComponentLink1URL: https://www.ti.com/lit/ds/sbos378/sbos378.pdf?ts=1615805217899&ref_url=https%253A%252F%252Fwww.google.com%252F; 02 MPN: INA185A1IDR
U402 = 510: SMT UQFN-36 3-3.6V 100MHz 32kB; 03 Manufacturer: Microchip; 00 Index: 510; 01 Name: IC MICROCONTROLLER dsPIC33CK32MP503 Microchip; 04 Main Group: IC; 05 Sub Group: MICROCONTROLLER; 06 Assembly: SMT; 11 Parameter 4: 3-3.6V; 12 Parameter 5: 100MHz; 13 Parameter 6: 32kB; 14 Modification Date: 22.03.2021; ComponentLink1Description: DATASHEET; ComponentLink1URL: https://ww1.microchip.com/downloads/en/DeviceDoc/dsPIC33CK256MP508-Family-Data-Sheet-DS70005349H.pdf; 02 MPN: dsPIC33CK32MP503

## Sheet PSU.SchDoc
size A3; SheetNumber: 5; SheetTotal: 6
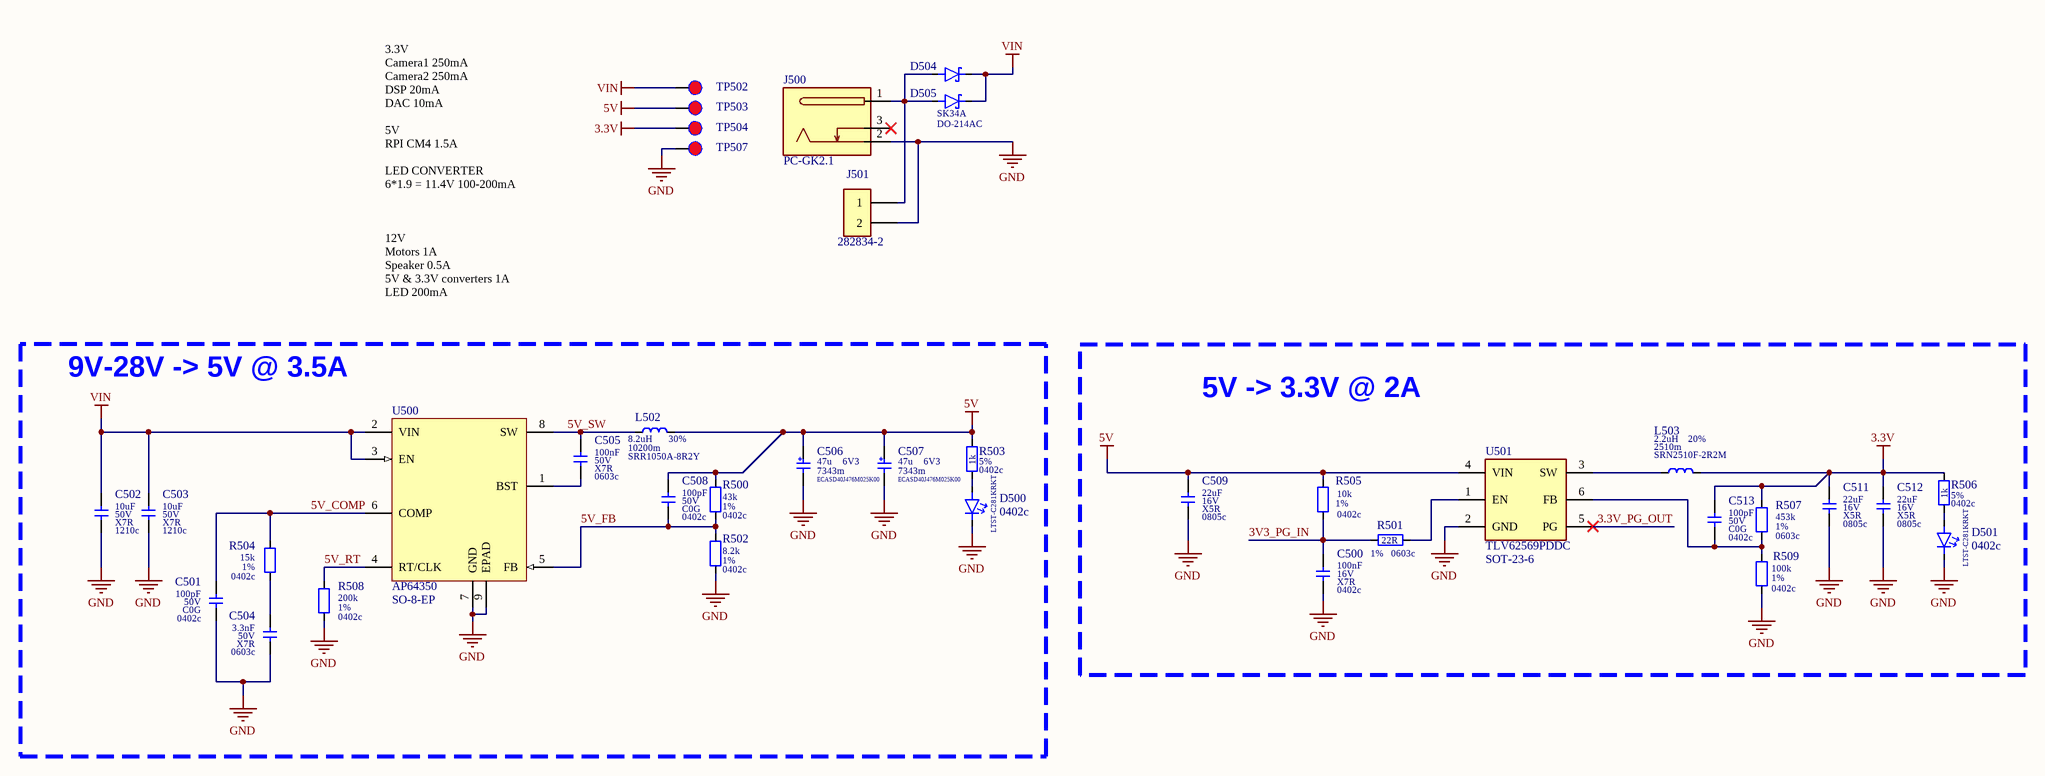
[diagram p4: PSU.SchDoc]

### Parts
C500  11 Parameter 4: X7R  07 Package: 0402c  08 Parameter 1: 100nF  09 Parameter 2: 16V  [CAPC1005X60L]  (hidden comment: CL05B104KO5NNNC)
C501  11 Parameter 4: C0G  07 Package: 0402c  08 Parameter 1: 100pF  09 Parameter 2: 50V  [CAPC1005X60L]  (hidden comment: GRM1555C1H101JA01D)
C502  11 Parameter 4: X7R  07 Package: 1210c  08 Parameter 1: 10uF  09 Parameter 2: 50V  [CAPC3225X270L]  (hidden comment: CL32B106KBJNNNE)
C503  11 Parameter 4: X7R  07 Package: 1210c  08 Parameter 1: 10uF  09 Parameter 2: 50V  [CAPC3225X270L]  (hidden comment: CL32B106KBJNNNE)
C504  11 Parameter 4: X7R  07 Package: 0603c  08 Parameter 1: 3.3nF  09 Parameter 2: 50V  [CAPC1608X90L]  (hidden comment: CL10B332KB8NNNC)
C505  11 Parameter 4: X7R  07 Package: 0603c  08 Parameter 1: 100nF  09 Parameter 2: 50V  [CAPC1608X90L]  (hidden comment: CL10B104KB8NNNC)
C506  09 Parameter 2: 6V3  08 Parameter 1: 47u  07 Package: 7343m  [CAPMP7343X20L]  (hidden comment: ECASD40J476M025K00)
C507  09 Parameter 2: 6V3  08 Parameter 1: 47u  07 Package: 7343m  [CAPMP7343X20L]  (hidden comment: ECASD40J476M025K00)
C508  11 Parameter 4: C0G  07 Package: 0402c  08 Parameter 1: 100pF  09 Parameter 2: 50V  [CAPC1005X60L]  (hidden comment: GRM1555C1H101JA01D)
C509  11 Parameter 4: X5R  07 Package: 0805c  08 Parameter 1: 22uF  09 Parameter 2: 16V  [CAPC2013X145L]  (hidden comment: CL21A226MOQNNNE)
C511  11 Parameter 4: X5R  07 Package: 0805c  08 Parameter 1: 22uF  09 Parameter 2: 16V  [CAPC2013X145L]  (hidden comment: CL21A226MOQNNNE)
C512  11 Parameter 4: X5R  07 Package: 0805c  08 Parameter 1: 22uF  09 Parameter 2: 16V  [CAPC2013X145L]  (hidden comment: CL21A226MOQNNNE)
C513  11 Parameter 4: C0G  07 Package: 0402c  08 Parameter 1: 100pF  09 Parameter 2: 50V  [CAPC1005X60L]  (hidden comment: GRM1555C1H101JA01D)
D500  07 Package: 0402c  [LEDSC100x50x35-2L]  (hidden comment: LTST-C281KRKT)
D501  07 Package: 0402c  [LEDSC100x50x35-2L]  (hidden comment: LTST-C281KRKT)
D504  SK34A  [DIOM4326X250L]  (value not drawn)
D505  07 Package: DO-214AC  [DIOM4326X250L]  (hidden comment: SK34A)
J500  PC-GK2.1  [NINIGI PC-GK2.1]
J501  282834-2  [TE 282834-2]
L502  09 Parameter 2: 30%  08 Parameter 1: 8.2uH  07 Package: 10200m  [IND102100X51L]  (hidden comment: SRR1050A-8R2Y)
L503  09 Parameter 2: 20%  08 Parameter 1: 2.2uH  07 Package: 2510m  [IND2510X10L]  (hidden comment: SRN2510F-2R2M)
R500  07 Package: 0402c  09 Parameter 2: 1%  08 Parameter 1: 43k  [RESC1005X40L]  (hidden comment: RC0402FR-0743KL)
R501  07 Package: 0603c  09 Parameter 2: 1%  08 Parameter 1: 22R  [RESC1608X55L]  (hidden comment: RC0603FR-0722RL)
R502  07 Package: 0402c  09 Parameter 2: 1%  08 Parameter 1: 8.2k  [RESC1005X40L]  (hidden comment: RC0402FR-078K2L)
R503  07 Package: 0402c  09 Parameter 2: 5%  08 Parameter 1: 1k  [RESC1005X40L]  (hidden comment: RC0402JR-071KL)
R504  07 Package: 0402c  09 Parameter 2: 1%  08 Parameter 1: 15k  [RESC1005X40L]  (hidden comment: RC0402FR-0715KL)
R505  07 Package: 0402c  09 Parameter 2: 1%  08 Parameter 1: 10k  [RESC1005X40L]  (hidden comment: RC0402FR-0710KL)
R506  07 Package: 0402c  09 Parameter 2: 5%  08 Parameter 1: 1k  [RESC1005X40L]  (hidden comment: RC0402JR-071KL)
R507  07 Package: 0603c  09 Parameter 2: 1%  08 Parameter 1: 453k  [RESC1608X55L]  (hidden comment: RC0603FR-07453KL)
R508  07 Package: 0402c  09 Parameter 2: 1%  08 Parameter 1: 200k  [RESC1005X40L]  (hidden comment: RC0402FR-07200KL)
R509  07 Package: 0402c  09 Parameter 2: 1%  08 Parameter 1: 100k  [RESC1005X40L]  (hidden comment: RC0402FR-07100KL)
TP502  TESTPAD  [TP 1.2mm]  (value not drawn)  (no BOM)
TP503  TESTPAD  [TP 1.2mm]  (value not drawn)  (no BOM)
TP504  TESTPAD  [TP 1.2mm]  (value not drawn)  (no BOM)
TP507  TESTPAD  [TP 1.2mm]  (value not drawn)  (no BOM)
U500  07 Package: SO-8-EP  [SOIC127P600X170_HS350x261-9L]  (hidden comment: AP64350)
U501  07 Package: SOT-23-6  [SOT95P280X110-6L]  (hidden comment: TLV62569PDDC)

### Blocks framed on the sheet
9V-28V -> 5V @ 3.5A: C501-C508 D500 L502 R500 R502-R504 R508 U500
5V -> 3.3V @ 2A: C500 C509 C511-C513 D501 L503 R501 R505-R507 R509 U501

### Nets
3.3V: C511.2 C512.2 C513.2 L503.2 R506.2 R507.2 TP504.1
5V: C506.1 C507.1 C508.2 C509.2 L502.2 R500.2 R503.2 R505.2 TP503.1 U501.4(VIN)
GND: C500.1 C501.1 C502.1 C503.1 C504.1 C506.2 C507.2 C509.1 C511.1 C512.1 D500.K D501.K J500.2 J501.2 R502.1 R508.1 R509.1 TP507.1 U500.7(GND) U500.9(EPAD) U501.2(GND)
VIN: C502.2 C503.2 D504.K D505.K TP502.1 U500.2(VIN) U500.3(EN)
3.3V_PG_OUT: U501.5(PG)
3V3_PG_IN: C500.2 R501.1 R505.1
5V_COMP: C501.2 R504.2 U500.6(COMP)
5V_FB: C508.1 R500.1 R502.2 U500.5(FB)
5V_RT: R508.2 U500.4(RT/CLK)
5V_SW: C505.2 L502.1 U500.8(SW)
NetC504_2: C504.2 R504.1
NetC505_1: C505.1 U500.1(BST)
NetC513_1: C513.1 R507.1 R509.2 U501.6(FB)
NetD500_A: D500.A R503.1
NetD501_A: D501.A R506.1
NetD504_A: D504.A D505.A J500.1 J501.1
NetL503_1: L503.1 U501.3(SW)
NetR501_2: R501.2 U501.1(EN)

Not connected (* = marked no-connect by the designer): J500 3*

### Notes on the sheet
- 3.3V
  Camera1 250mA
  Camera2 250mA
  DSP 20mA
  DAC 10mA
  5V
  RPI CM4 1.5A
  LED CONVERTER
  6*1.9 = 11.4V 100-200mA
  12V
  Motors 1A
  Speaker 0.5A
  5V & 3.3V converters 1A
  LED 200mA
- Version:
- SVN Rev:
- Sheet:
- File:
- Modification Date:
- Variant:
- of
- Sheet Size:
- A3
- SaraAI
- (in symbol 260) +

### Library data of the parts
C500 = 138: SMT 0402c 100nF 16V 10% X7R 25.8MHz 125'C; 03 Manufacturer: Samsung; 00 Index: 138; 01 Name: CAPACITOR CERAMIC CL05B104KO5NNNC Samsung; 05 Sub Group: CERAMIC; 04 Main Group: CAPACITOR; 06 Assembly: SMT; 12 Parameter 5: 25.8MHz; 13 Parameter 6: 125'C; 14 Modification Date: 16.11.2020; ComponentLink1Description: DATASHEET; ComponentLink1URL: E:\Praca\Mindsailors\Mindsailors Altium\Database Library\Datasheets\CAPACITOR\Samsung CL05B104KO5NNNC.pdf; 02 MPN: CL05B104KO5NNNC; 10 Parameter 3: 10%
C501 C508 C513 = 137: SMT 0402c 100pF 50V 5% C0G 814MHz 125'C; 03 Manufacturer: Murata; 00 Index: 137; 01 Name: CAPACITOR CERAMIC GRM1555C1H101JA01D Murata; 05 Sub Group: CERAMIC; 04 Main Group: CAPACITOR; 06 Assembly: SMT; 12 Parameter 5: 814MHz; 13 Parameter 6: 125'C; 14 Modification Date: 16.11.2020; ComponentLink1Description: DATASHEET; ComponentLink1URL: E:\Praca\Mindsailors\Mindsailors Altium\Database Library\Datasheets\CAPACITOR\Murata GRM1555C1H101JA01D.pdf; 02 MPN: GRM1555C1H101JA01D; 10 Parameter 3: 5%
C502 C503 = 259: SMT 1210c 10uF 50V 10% X7R 125°C; 03 Manufacturer: Samsung; 00 Index: 259; 01 Name: CAPACITOR CERAMIC CL32B106KBJNNNC Samsung; 05 Sub Group: CERAMIC; 04 Main Group: CAPACITOR; 06 Assembly: SMT; 13 Parameter 6: 125°C; 14 Modification Date: 25.01.2021; ComponentLink1Description: DATASHEET; ComponentLink1URL: http://weblib.samsungsem.com/mlcc/mlcc-ec-data-sheet.do?partNumber=CL32B106KBJNNN; 02 MPN: CL32B106KBJNNNE; 10 Parameter 3: 10%
C504 = 206: SMT 0603c 3.3nF 50V 10% X7R 125°C; 03 Manufacturer: Samsung; 00 Index: 206; 01 Name: CAPACITOR CERAMIC CL10B332KB8NNNC Samsung; 05 Sub Group: CERAMIC; Library Directory: sym_basics/; Fotprint Directory: fot_ipc/; 04 Main Group: CAPACITOR; 06 Assembly: SMT; 13 Parameter 6: 125°C; 14 Modification Date: 25.01.2021; ComponentLink1Description: DATASHEET; ComponentLink1URL: http://weblib.samsungsem.com/mlcc/mlcc-ec-data-sheet.do?partNumber=CL10B332KB8NNN; 02 MPN: CL10B332KB8NNNC; 10 Parameter 3: 10%
C505 = 164: SMT 0603c 100nF 50V 10% X7R 125'C; 03 Manufacturer: Samsung; 00 Index: 164; 01 Name: CAPACITOR CERAMIC CL10B104KB8NNNC Samsung; 05 Sub Group: CERAMIC; 04 Main Group: CAPACITOR; 06 Assembly: SMT; 13 Parameter 6: 125'C; 14 Modification Date: 21.12.2020; ComponentLink1Description: DATASHEET; ComponentLink1URL: E:\Praca\Mindsailors\Mindsailors Altium\Database Library\Datasheets\CAPACITOR\Samsung CL01B104KB8NNNC.pdf; 02 MPN: CL10B104KB8NNNC; 10 Parameter 3: 10%
C506 C507 = 260: SMT 7343m 47u 6V3 20% 25mOhm 1.8A 105°C; 03 Manufacturer: Murata; 00 Index: 260; 01 Name: CAPACITOR POLYMER ECASD40J476M025K00 Murata; 04 Main Group: CAPACITOR; 05 Sub Group: POLYMER; 06 Assembly: SMT; 11 Parameter 4: 25mOhm; 12 Parameter 5: 1.8A; 13 Parameter 6: 105°C; 14 Modification Date: 25.01.2021; ComponentLink1Description: DATASHEET; ComponentLink1URL: https://pl.mouser.com/datasheet/2/281/c90e-1501405.pdf; 10 Parameter 3: 20%; 02 MPN: ECASD40J476M025K00
C509 C511 C512 = 81: SMT 0805c 22uF 16V 20% X5R 1.6MHz 85'C; 03 Manufacturer: Samsung; 00 Index: 81; 01 Name: CAPACITOR CERAMIC CL21A226MOQNNNE Samsung; 05 Sub Group: CERAMIC; 04 Main Group: CAPACITOR; 06 Assembly: SMT; 12 Parameter 5: 1.6MHz; 13 Parameter 6: 85'C; 14 Modification Date: 16.11.2020; ComponentLink1Description: DATASHEET; ComponentLink1URL: E:\Praca\Mindsailors\Mindsailors Altium\Database Library\Datasheets\CAPACITOR\Samsung CL21A226MOQNNN.pdf; 02 MPN: CL21A226MOQNNNE; 10 Parameter 3: 20%
D500 D501 = 176: SMT 0402c RED Striaight 18...54mcd  130deg 2.0V; 03 Manufacturer: LITEON; 00 Index: 176; 01 Name: DIODE LED LTST-C281KRKT LITEON; 04 Main Group: DIODE; 05 Sub Group: LED; 06 Assembly: SMT; 11 Parameter 4: 18...54mcd; 12 Parameter 5: 130deg; 13 Parameter 6: 2.0V; 14 Modification Date: 21.01.2021; ComponentLink1Description: DATASHEET; ComponentLink1URL: E:\Praca\Mindsailors\Mindsailors Altium\Database Library\Datasheets\DIODE\LITEON LTST-C281KRKT.pdf; 08 Parameter 1: RED; 10 Parameter 3: Striaight; 02 MPN: LTST-C281KRKT
D504 D505 = 793: SMT DO-214AC 40V 3A 0.55V 70A 500uA; 03 Manufacturer: Taiwan Semiconductor; 00 Index: 793; 01 Name: DIODE SCHOTTKY SK34A Taiwan Semiconductor; 04 Main Group: DIODE; Library Directory: sym_basics/; Fotprint Directory: fot_ipc/; 05 Sub Group: SCHOTTKY; 06 Assembly: SMT; 11 Parameter 4: 70A; 12 Parameter 5: 500uA; 14 Modification Date: 29.11.2021; ComponentLink1Description: DATASHEET; ComponentLink1URL: https://datasheet.octopart.com/SK36A-R3G-Taiwan-Semiconductor-datasheet-94061880.pdf; 10 Parameter 3: 0.55V; 09 Parameter 2: 3A; 08 Parameter 1: 40V; 02 MPN: SK34A
  D504: 07 Package: DO-214AC
J500 = 515: THT DC BARREL JACK Right Angle; 03 Manufacturer: NINIGI; 00 Index: 515; 01 Name: CONNECTOR WIRE PC-GK2.1 NINIGI; 04 Main Group: CONNECTOR; 05 Sub Group: WIRE; Library Directory: sym_other/; Fotprint Directory: fot_other/; 06 Assembly: THT; 11 Parameter 4: Right Angle; 14 Modification Date: 29.03.2021; ComponentLink1Description: DATASHEET; ComponentLink1URL: https://www.tme.eu/pl/details/pc-gk2.1/zlacza-dc/ninigi/; 09 Parameter 2: DC BARREL JACK; 02 MPN: PC-GK2.1; 07 Package: *
J501 = 978: THT 1x2 2.54mm Straight 150V 10A; 03 Manufacturer: TE Connectivity; 00 Index: 978; 01 Name: CONNECTOR WIRE 282834-2 TE Connectivity; 04 Main Group: CONNECTOR; 05 Sub Group: WIRE; Library Directory: sym_basics/; Fotprint Directory: fot_ipc/; 06 Assembly: THT; 13 Parameter 6: 10A; 14 Modification Date: 03.01.2022; ComponentLink1Description: DATASHEET; ComponentLink1URL: https://www.te.com/usa-en/product-282834-2.html; 09 Parameter 2: 2.54mm; 08 Parameter 1: 1x2; 11 Parameter 4: Straight; 12 Parameter 5: 150V; 07 Package: *; 02 MPN: 282834-2
L502 = 457: SMT 10200m 8.2uH 0,3 5A 4.85A 22mOhm 21MHz; 03 Manufacturer: Bourns; 01 Name: INDUCTOR WIREWOUND SRR1050A-8R2Y  Bourns; 05 Sub Group: WIREWOUND; 00 Index: 457; 04 Main Group: INDUCTOR; 06 Assembly: SMT; 12 Parameter 5: 22mOhm; 13 Parameter 6: 21MHz; 14 Modification Date: 14.02.2021; ComponentLink1Description: DATASHEET; ComponentLink1URL: https://pl.mouser.com/datasheet/2/54/srr1050a-1391598.pdf; 11 Parameter 4: 4.85A; 10 Parameter 3: 5A; 02 MPN: SRR1050A-8R2Y
L503 = 456: SMT 2510m 2.2uH 0,2 2.6A 2.8A 78mOhm 40MHz; 03 Manufacturer: Bourns; 01 Name: INDUCTOR WIREWOUND SRN2510F-2R2M Bourns; 05 Sub Group: WIREWOUND; 00 Index: 456; 04 Main Group: INDUCTOR; 06 Assembly: SMT; 12 Parameter 5: 78mOhm; 13 Parameter 6: 40MHz; 14 Modification Date: 14.02.2021; ComponentLink1Description: DATASHEET; ComponentLink1URL: http://www.farnell.com/datasheets/2644240.pdf; 11 Parameter 4: 2.8A; 10 Parameter 3: 2.6A; 02 MPN: SRN2510F-2R2M
R500 = 655: SMT 0402c 43k 1% 62.5mW 100ppm/K 50V; 03 Manufacturer: Yageo; 00 Index: 655; 01 Name: RESISTOR THICK FILM RC0402FR-0743KL Yageo; 05 Sub Group: THICK FILM; Library Directory: sym_basics/; Fotprint Directory: fot_ipc/; 04 Main Group: RESISTOR; 06 Assembly: SMT; 11 Parameter 4: 100ppm/K; 12 Parameter 5: 50V; 14 Modification Date: 10.05.2021; ComponentLink1Description: DATASHEET; ComponentLink1URL: https://www.yageo.com/upload/media/product/products/datasheet/rchip/PYu-RC_Group_51_RoHS_L_11.pdf; 10 Parameter 3: 62.5mW; 02 MPN: RC0402FR-0743KL
R501 = 318: SMT 0603c 22R 1% 100mW 100ppm/K 75V; 03 Manufacturer: Yageo; 00 Index: 318; 01 Name: RESISTOR THICK FILM RC0603FR-0722RL Yageo; 05 Sub Group: THICK FILM; Library Directory: sym_basics/; Fotprint Directory: fot_ipc/; 04 Main Group: RESISTOR; 06 Assembly: SMT; 11 Parameter 4: 100ppm/K; 12 Parameter 5: 75V; 14 Modification Date: 25.01.2021; ComponentLink1Description: DATASHEET; ComponentLink1URL: https://www.yageo.com/upload/media/product/products/datasheet/rchip/PYu-RC_Group_51_RoHS_L_11.pdf; 10 Parameter 3: 100mW; 02 MPN: RC0603FR-0722RL
R502 = 705: SMT 0402c 8.2k 1% 62.5mW 100ppm/K 50V; 03 Manufacturer: Yageo; 00 Index: 705; 01 Name: RESISTOR THICK FILM RC0402FR-078K2L Yageo; 05 Sub Group: THICK FILM; Library Directory: sym_basics/; Fotprint Directory: fot_ipc/; 04 Main Group: RESISTOR; 06 Assembly: SMT; 11 Parameter 4: 100ppm/K; 12 Parameter 5: 50V; 14 Modification Date: 10.05.2021; ComponentLink1Description: DATASHEET; ComponentLink1URL: https://www.yageo.com/upload/media/product/products/datasheet/rchip/PYu-RC_Group_51_RoHS_L_11.pdf; 10 Parameter 3: 62.5mW; 02 MPN: RC0402FR-078K2L
R503 R506 = 131: SMT 0402c 1k 5% 62.5mW 200ppm/K 50V; 03 Manufacturer: Yageo; 00 Index: 131; 01 Name: RESISTOR THICK FILM RC0402JR-071KL Yageo; 05 Sub Group: THICK FILM; 04 Main Group: RESISTOR; 06 Assembly: SMT; 11 Parameter 4: 200ppm/K; 12 Parameter 5: 50V; 14 Modification Date: 16.11.2020; ComponentLink1Description: DATASHEET; ComponentLink1URL: E:\Praca\Mindsailors\Mindsailors Altium\Database Library\Datasheets\RESISTOR\Yageo RC_L Series.pdf; 10 Parameter 3: 62.5mW; 02 MPN: RC0402JR-071KL
R504 = 572: SMT 0402c 15k 1% 62.5mW 100ppm/K 50V; 03 Manufacturer: Yageo; 00 Index: 572; 01 Name: RESISTOR THICK FILM RC0402FR-0715KL Yageo; 05 Sub Group: THICK FILM; Library Directory: sym_basics/; Fotprint Directory: fot_ipc/; 04 Main Group: RESISTOR; 06 Assembly: SMT; 11 Parameter 4: 100ppm/K; 12 Parameter 5: 50V; 14 Modification Date: 10.05.2021; ComponentLink1Description: DATASHEET; ComponentLink1URL: https://www.yageo.com/upload/media/product/products/datasheet/rchip/PYu-RC_Group_51_RoHS_L_11.pdf; 10 Parameter 3: 62.5mW; 02 MPN: RC0402FR-0715KL
R505 = 15: SMT 0402c 10k 1% 62.5mW 100ppm/K 50V; 03 Manufacturer: Yageo; 00 Index: 15; 01 Name: RESISTOR THICK FILM RC0402FR-0710KL Yageo; 05 Sub Group: THICK FILM; 04 Main Group: RESISTOR; 06 Assembly: SMT; 11 Parameter 4: 100ppm/K; 12 Parameter 5: 50V; 14 Modification Date: 16.11.2020; ComponentLink1Description: DATASHEET; ComponentLink1URL: E:\Praca\Mindsailors\Mindsailors Altium\Database Library\Datasheets\RESISTOR\Yageo RC_L Series.pdf; 10 Parameter 3: 62.5mW; 02 MPN: RC0402FR-0710KL
R507 = 373: SMT 0603c 453k 1% 100mW 100ppm/K 75V; 03 Manufacturer: Yageo; 00 Index: 373; 01 Name: RESISTOR THICK FILM RC0603FR-07453KL Yageo; 05 Sub Group: THICK FILM; 04 Main Group: RESISTOR; 06 Assembly: SMT; 11 Parameter 4: 100ppm/K; 12 Parameter 5: 75V; 14 Modification Date: 25.01.2021; ComponentLink1Description: DATASHEET; ComponentLink1URL: https://www.yageo.com/upload/media/product/products/datasheet/rchip/PYu-RC_Group_51_RoHS_L_11.pdf; 10 Parameter 3: 100mW; 02 MPN: RC0603FR-07453KL
R508 = 600: SMT 0402c 200k 1% 62.5mW 100ppm/K 50V; 03 Manufacturer: Yageo; 00 Index: 600; 01 Name: RESISTOR THICK FILM RC0402FR-07200KL Yageo; 05 Sub Group: THICK FILM; Library Directory: sym_basics/; Fotprint Directory: fot_ipc/; 04 Main Group: RESISTOR; 06 Assembly: SMT; 11 Parameter 4: 100ppm/K; 12 Parameter 5: 50V; 14 Modification Date: 10.05.2021; ComponentLink1Description: DATASHEET; ComponentLink1URL: https://www.yageo.com/upload/media/product/products/datasheet/rchip/PYu-RC_Group_51_RoHS_L_11.pdf; 10 Parameter 3: 62.5mW; 02 MPN: RC0402FR-07200KL
R509 = 18: SMT 0402c 100k 1% 62.5mW 100ppm/K 50V; 03 Manufacturer: Yageo; 00 Index: 18; 01 Name: RESISTOR THICK FILM RC0402FR-07100KL Yageo; 05 Sub Group: THICK FILM; 04 Main Group: RESISTOR; 06 Assembly: SMT; 11 Parameter 4: 100ppm/K; 12 Parameter 5: 50V; 14 Modification Date: 16.11.2020; ComponentLink1Description: DATASHEET; ComponentLink1URL: E:\Praca\Mindsailors\Mindsailors Altium\Database Library\Datasheets\RESISTOR\Yageo RC_L Series.pdf; 10 Parameter 3: 62.5mW; 02 MPN: RC0402FR-07100KL
TP502-TP504 TP507 = 10: 00 Index: 10; 01 Name: PCB COMPONENT TESTPAD TESTPAD; 04 Main Group: PCB COMPONENT; 02 MPN: TESTPAD; 05 Sub Group: TESTPAD; 14 Modification Date: 16.11.2020
U500 = 986: SMT SO-8-EP 40V 3.5A 100kHz - 2.2MHz; 03 Manufacturer: Diodes; 00 Index: 986; 01 Name: IC DCDC CONVERTER AP64350 Diodes; 04 Main Group: IC; 05 Sub Group: DCDC CONVERTER; 16 Replacements: AP64500SP-13; Library Directory: sym_other/; Fotprint Directory: fot_ipc/; 06 Assembly: SMT; 11 Parameter 4: 40V; 12 Parameter 5: 3.5A; 13 Parameter 6: 100kHz - 2.2MHz; 14 Modification Date: 14.02.2022; ComponentLink1Description: DATASHEET; ComponentLink1URL: https://www.diodes.com/assets/Datasheets/AP64350.pdf; 02 MPN: AP64350
U501 = 459: SMT SOT-23-6 5.5V 2A 1.5MHz; 03 Manufacturer: Texas Instruments; 00 Index: 459; 01 Name: IC DCDC CONVERTER TLV62569PDDC Texas Instruments; 04 Main Group: IC; 05 Sub Group: DCDC CONVERTER; 06 Assembly: SMT; 11 Parameter 4: 5.5V; 12 Parameter 5: 2A; 13 Parameter 6: 1.5MHz; 14 Modification Date: 14.02.2021; ComponentLink1Description: DATASHEET; ComponentLink1URL: https://www.ti.com/lit/ds/symlink/tlv62569.pdf?ts=1613311991034&ref_url=https%253A%252F%252Fwww.google.com%252F; 02 MPN: TLV62569PDDC